# EAGLE design gs (EAGLE 9.6.2)

## Sheet 1 of 2
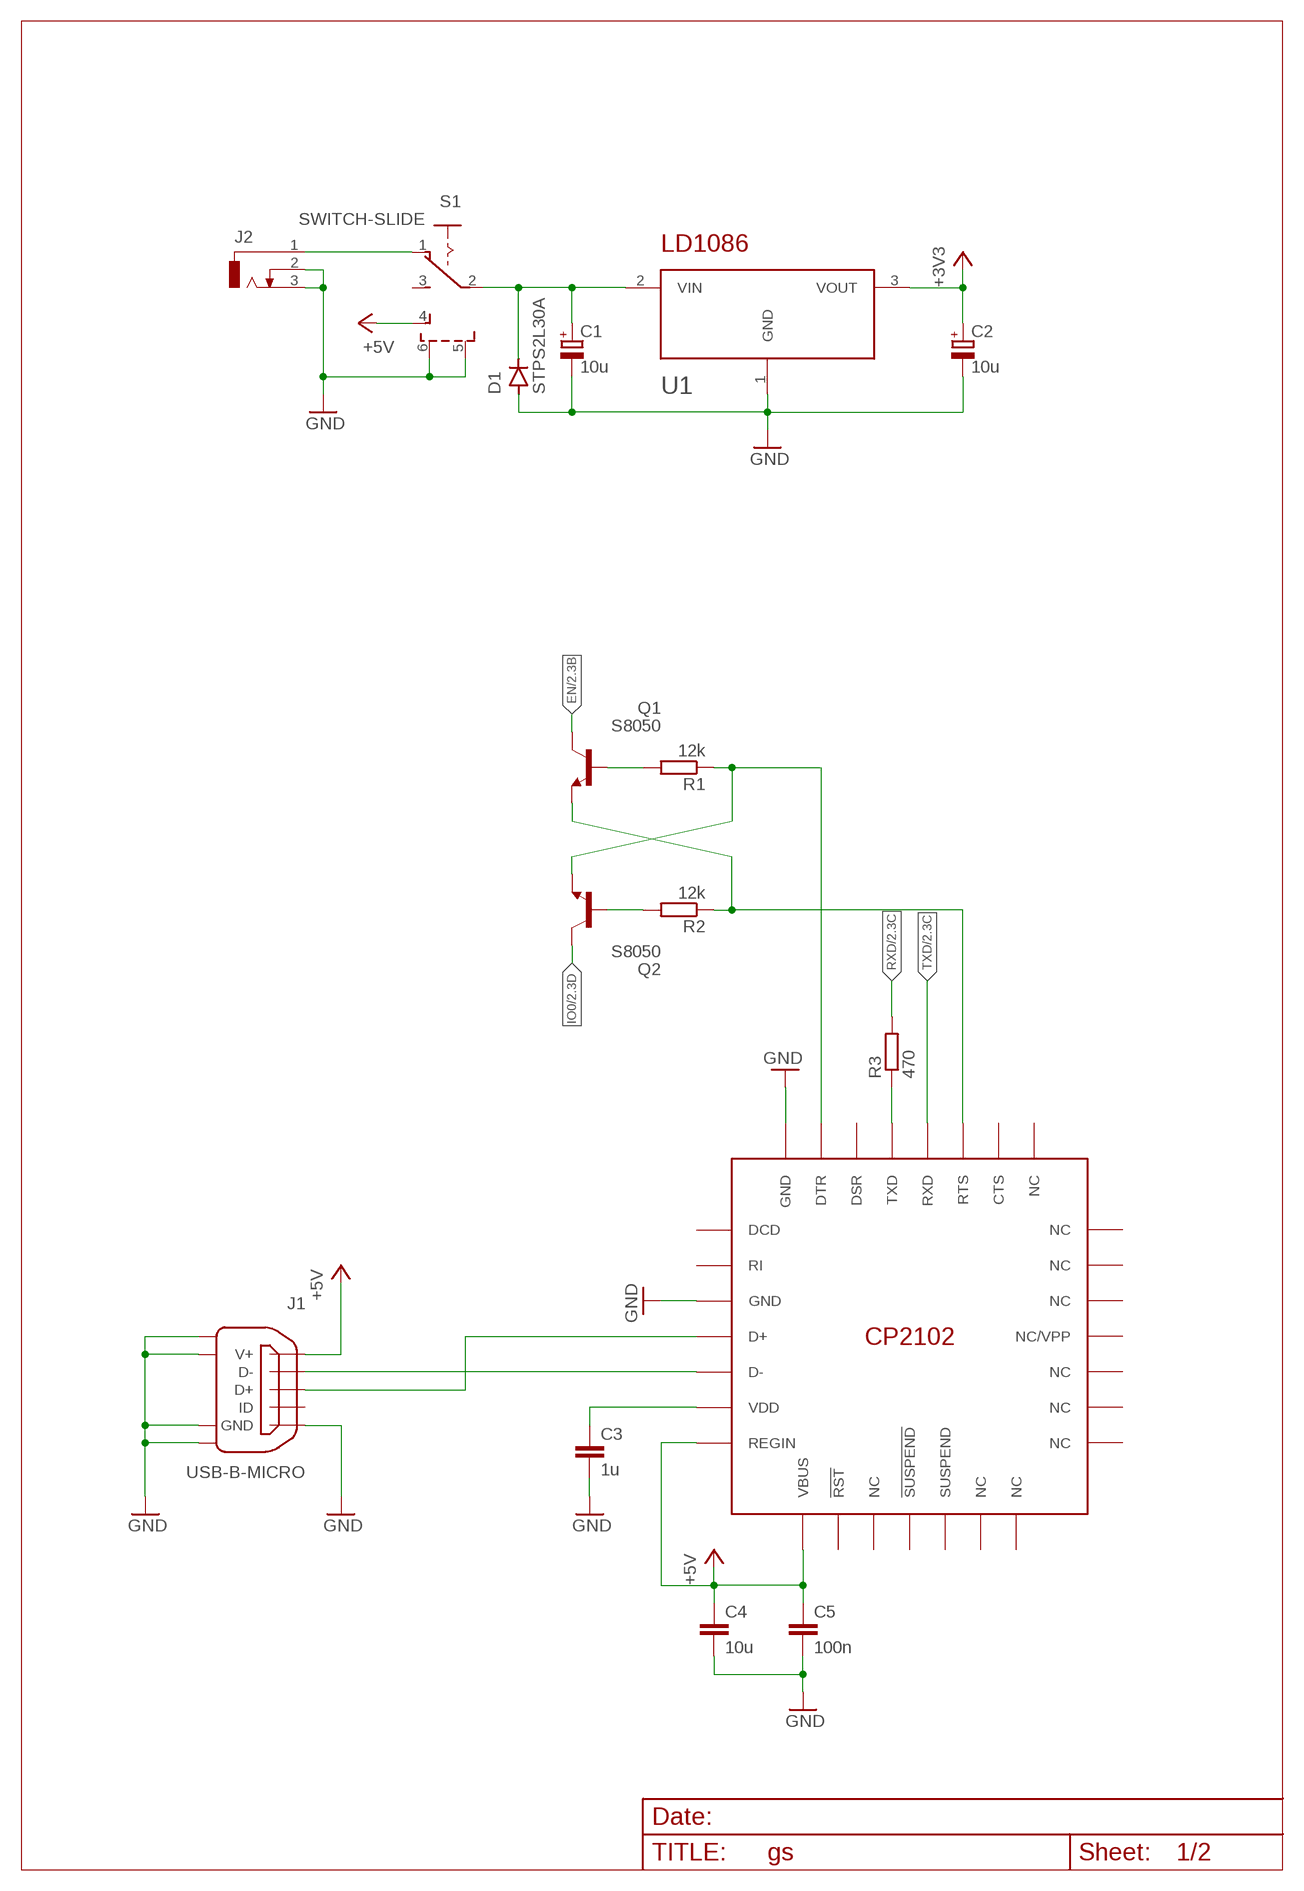
[diagram p0: schematic, sheet 1]

### Parts
C1  10u  CPOL-EUSMCC  [SMC_C]
C2  10u  CPOL-EUSMCC  [SMC_C]
C3  1u  C-EUC0805  [C0805]
C4  10u  C-EUC0805  [C0805]
C5  100n  C-EUC0805  [C0805]
D1  STPS2L30A  [DIOM4225X245N]
J1  USB-B-MICRO  [USB-B-MICRO]
J2  DCJ0303  [DCJ0303]
Q1  S8050  [SOT95P237X110-3N]
Q2  S8050  [SOT95P237X110-3N]
R1  12k  R-EU_R0805  [R0805]
R2  12k  R-EU_R0805  [R0805]
R3  470  R-EU_R0805  [R0805]
S1  SWITCH-SLIDE  [SWITCH-SLIDE]
U1  LD1086DT33TR  [TO228P972X240-3N]
U2  CP2102  [QFN50P500X500X100-29T300N]

### Nets
+3V3: C2.+ U1.3(VOUT) ; also sheet 2
+5V: C4.1 C5.1 J1.1(V+) S1.4 U2.7(REGIN) U2.8(VBUS)
EN: Q1.3(C) ; also sheet 2
GND: C1.- C2.- C3.2 C4.2 C5.2 D1.2(A) J1.5(GND) J1.6 J1.7 J1.8 J1.9 J2.2 J2.3 S1.5(S1) S1.6(S2) U1.1(GND) U2.3(GND) U2.29(GND) ; also sheet 2
IO0: Q2.3(C) ; also sheet 2
N$5: J1.2(D-) U2.5(D-)
N$6: J1.3(D+) U2.4(D+)
N$7: R3.1 U2.26(TXD)
N$8: Q1.1(B) R1.2
N$9: Q2.1(B) R2.2
N$10: Q2.2(E) R1.1 U2.28(DTR)
N$11: Q1.2(E) R2.1 U2.24(RTS)
N$12: C3.1 U2.6(VDD)
N$14: J2.1 S1.1
N$19: C1.+ D1.1(C) S1.2 U1.2(VIN)
RXD: R3.2 ; also sheet 2
TXD: U2.25(RXD) ; also sheet 2
Unconnected: J1.4(ID) S1.3 U2.1(DCD) U2.2(RI) U2.9(!RST) U2.10(NC) U2.11(!SUSPEND) U2.12(SUSPEND) U2.13(NC) U2.14(NC) U2.15(NC) U2.16(NC) U2.17(NC) U2.18(NC/VPP) U2.19(NC) U2.20(NC) U2.21(NC) U2.22(NC) U2.23(CTS) U2.27(DSR)

## Sheet 2 of 2
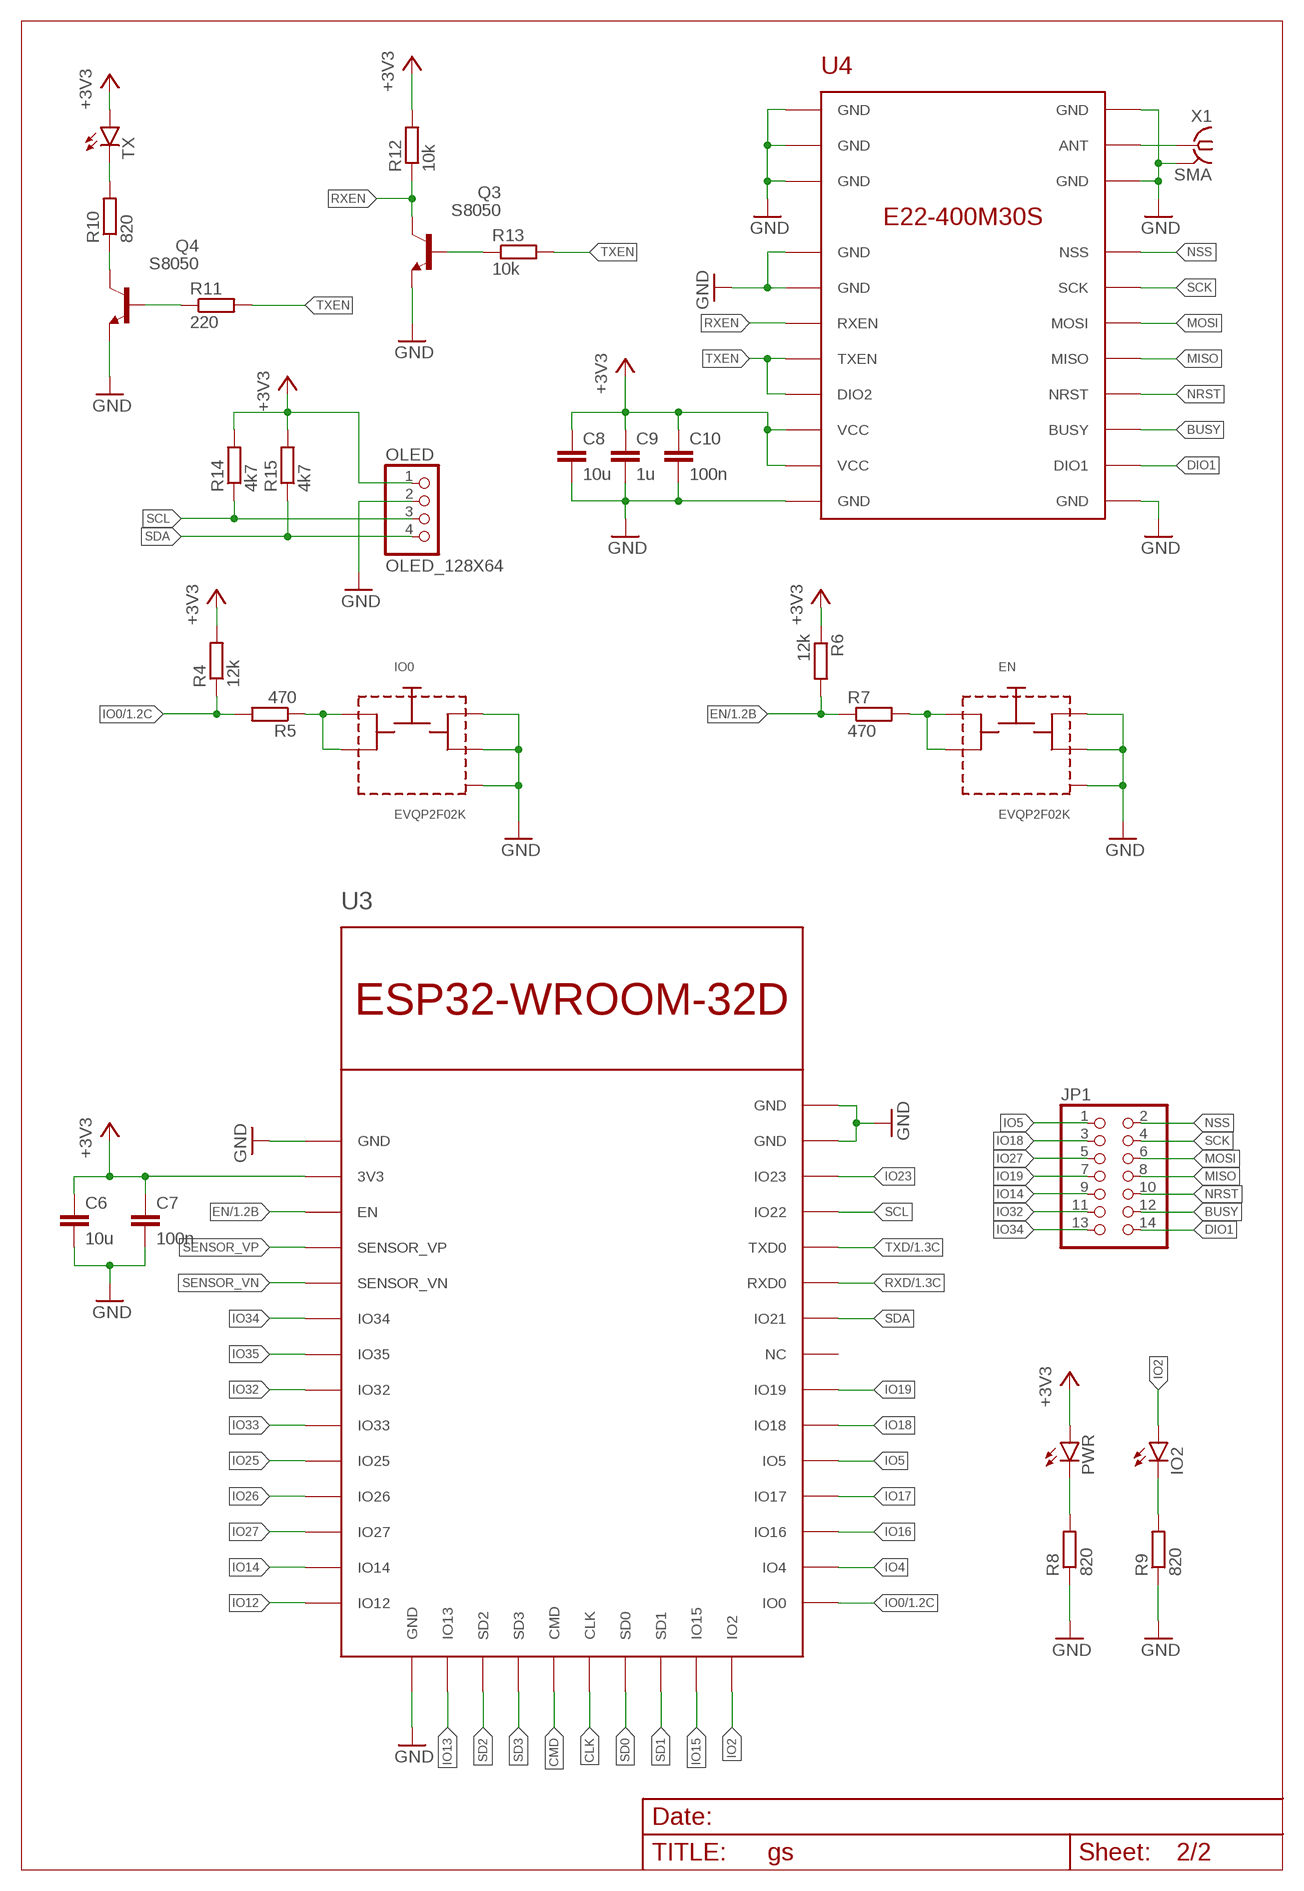
[diagram p1: schematic, sheet 2]

### Parts
C6  10u  C-EUC0805  [C0805]
C7  100n  C-EUC0805  [C0805]
C8  10u  C-EUC0805  [C0805]
C9  1u  C-EUC0805  [C0805]
C10  100n  C-EUC0805  [C0805]
EN  EVQP2F02K  [EVQP2F02K]
IO0  EVQP2F02K  [EVQP2F02K]
IO2  LEDCHIP-LED0805  [CHIP-LED0805]
JP1  PINHD-2X7  [2X07]
OLED  OLED_128X64  [OLED_128X64]
PWR  LEDCHIP-LED0805  [CHIP-LED0805]
Q3  S8050  [SOT95P237X110-3N]
Q4  S8050  [SOT95P237X110-3N]
R4  12k  R-EU_R0805  [R0805]
R5  470  R-EU_R0805  [R0805]
R6  12k  R-EU_R0805  [R0805]
R7  470  R-EU_R0805  [R0805]
R8  820  R-EU_R0805  [R0805]
R9  820  R-EU_R0805  [R0805]
R10  820  R-EU_R0805  [R0805]
R11  220  R-EU_R0805  [R0805]
R12  10k  R-EU_R0805  [R0805]
R13  10k  R-EU_R0805  [R0805]
R14  4k7  R-EU_R0805  [R0805]
R15  4k7  R-EU_R0805  [R0805]
TX  LEDCHIP-LED0805  [CHIP-LED0805]
U3  ESP32-WROOM-32D  [ESP32-SOLO-1]
U4  E22-400M30S  [E22-400M30S]
X1  SMA  [SMA]

### Nets
+3V3: C6.1 C7.1 C8.1 C9.1 C10.1 OLED.1 PWR.A R4.2 R6.1 R12.2 R14.2 R15.2 TX.A U3.2(3V3) U4.9(VCC) U4.10(VCC) ; also sheet 1
BUSY: JP1.12 U4.14(BUSY)
CLK: U3.20(CLK)
CMD: U3.19(CMD)
DIO1: JP1.14 U4.13(DIO1)
EN: R6.2 R7.1 U3.3(EN) ; also sheet 1
GND: C6.2 C7.2 C8.2 C9.2 C10.2 EN.3 EN.4 EN.5 IO0.3 IO0.4 IO0.5 OLED.2 Q3.2(E) Q4.2(E) R8.1 R9.1 U3.1(GND) U3.15(GND) U3.38(GND) U3.39(GND) U4.1(GND) U4.2(GND) U4.3(GND) U4.4(GND) U4.5(GND) U4.11(GND) U4.12(GND) U4.20(GND) U4.22(GND) X1.G@1 X1.G@2 X1.G@3 X1.G@4 ; also sheet 1
IO0: R4.1 R5.2 U3.25(IO0) ; also sheet 1
IO2: IO2.A U3.24(IO2)
IO4: U3.26(IO4)
IO5: JP1.1 U3.29(IO5)
IO12: U3.14(IO12)
IO13: U3.16(IO13)
IO14: JP1.9 U3.13(IO14)
IO15: U3.23(IO15)
IO16: U3.27(IO16)
IO17: U3.28(IO17)
IO18: JP1.3 U3.30(IO18)
IO19: JP1.7 U3.31(IO19)
IO23: U3.37(IO23)
IO25: U3.10(IO25)
IO26: U3.11(IO26)
IO27: JP1.5 U3.12(IO27)
IO32: JP1.11 U3.8(IO32)
IO33: U3.9(IO33)
IO34: JP1.13 U3.6(IO34)
IO35: U3.7(IO35)
MISO: JP1.8 U4.16(MISO)
MOSI: JP1.6 U4.17(MOSI)
N$1: PWR.C R8.2
N$2: IO2.C R9.2
N$3: EN.1 EN.2 R7.2
N$4: IO0.1 IO0.2 R5.1
N$13: U4.21(ANT) X1.1
N$15: Q4.3(C) R10.1
N$16: Q3.1(B) R13.1
N$17: Q4.1(B) R11.1
N$18: R10.2 TX.C
NRST: JP1.10 U4.15(NRST)
NSS: JP1.2 U4.19(NSS)
RXD: U3.34(RXD0) ; also sheet 1
RXEN: Q3.3(C) R12.1 U4.6(RXEN)
SCK: JP1.4 U4.18(SCK)
SCL: OLED.3 R14.1 U3.36(IO22)
SD0: U3.21(SD0)
SD1: U3.22(SD1)
SD2: U3.17(SD2)
SD3: U3.18(SD3)
SDA: OLED.4 R15.1 U3.33(IO21)
SENSOR_VN: U3.5(SENSOR_VN)
SENSOR_VP: U3.4(SENSOR_VP)
TXD: U3.35(TXD0) ; also sheet 1
TXEN: R11.2 R13.2 U4.7(TXEN) U4.8(DIO2)
Unconnected: U3.32(NC)

## Library data of the parts
C1 C2 = rcl:CPOL-EU: POLARIZED CAPACITOR, European symbol; SPICEPREFIX: C; TME: 293D106X9025C2TE3
C3 C9 = rcl:C-EU: CAPACITOR, European symbol; SPICEPREFIX: C; TME: CC0805KKX7R8105
C4 C6 C8 = rcl:C-EU: CAPACITOR, European symbol; SPICEPREFIX: C; TME: CL21A106KAYNNNG
C5 C7 C10 = rcl:C-EU: CAPACITOR, European symbol; SPICEPREFIX: C; TME: CC0805KRX7R8104
D1 = fossa:STPS2L30A; TME: STPS2L30A
EN IO0 = fossa:EVQP2F02K; TME: EVQP2F02K
IO2 PWR TX = led:LED: LED OSRAM: - CHIPLED LG R971, LG N971, LY N971, LG Q971, LY Q971, LO R971, LY R971 LH N974, LH R974 LS Q976, LO Q976, LY Q976 LO Q996 - Hyper CHIPLED LW Q18S LB Q993, LB Q99A, LB R99A - SideLED LS A670, LO A670, LY A670, LG A670, LP A670 LB A673, LV A673, LT A673, LW A673 LH A674 LY A675 LS A676, LA A676, LO A676, LY A676, LW A676 LS A679, LY A679, LG A679 - Hyper Micro SIDELED® LS Y876, LA Y876, LO Y876, LY Y876 LT Y87S - SmartLED LW L88C, LW L88S LB L89C, LB L89S, LG L890 LS L89K, LO L89K, LY L89K LS L896, LA L896, LO L896, LY L896 - TOPLED LS T670, LO T670, LY T670, LG T670, LP T670 LSG T670, LSP T670, LSY T670, LOP T670, LYG T670 LG T671, LOG T671, LSG T671 LB T673, LV T673, LT T673, LW T673 LH T674 LS T676, LA T676, LO T676, LY T676, LB T676, LH T676, LSB T676, LW T676 LB T67C, LV T67C, LT T67C, LS T67K, LO T67K, LY T67K, LW E67C LS E67B, LA E67B, LO E67B, LY E67B, LB E67C, LV E67C, LT E67C LW T67C LS T679, LY T679, LG T679 LS T770, LO T770, LY T770, LG T770, LP T770 LB T773, LV T773, LT T773, LW T773 LH T774 LS E675, LA E675, LY E675, LS T675 LS T776, LA T776, LO T776, LY T776, LB T776 LHGB T686 LT T68C, LB T68C - Hyper Mini TOPLED® LB M676 - Mini TOPLED Santana® LG M470 LS M47K, LO M47K, LY M47K Source: http://www.osram.convergy.de LUXEON: - LUMILED® LXK2-PW12-R00, LXK2-PW12-S00, LXK2-PW14-U00, LXK2-PW14-V00 LXK2-PM12-R00, LXK2-PM12-S00, LXK2-PM14-U00 LXK2-PE12-Q00, LXK2-PE12-R00, LXK2-PE12-S00, LXK2-PE14-T00, LXK2-PE14-U00 LXK2-PB12-K00, LXK2-PB12-L00, LXK2-PB12-M00, LXK2-PB14-N00, LXK2-PB14-P00, LXK2-PB14-Q00 LXK2-PR12-L00, LXK2-PR12-M00, LXK2-PR14-Q00, LXK2-PR14-R00 LXK2-PD12-Q00, LXK2-PD12-R00, LXK2-PD12-S00 LXK2-PH12-R00, LXK2-PH12-S00 LXK2-PL12-P00, LXK2-PL12-Q00, LXK2-PL12-R00 Source: www.luxeon.com KINGBRIGHT: KA-3528ASYC Source: www.kingbright.com; TME: KP-2012LSURCK
J1 = fossa:USB-B-MICRO; TME: 10118193-0001LF/C
J2 = fossa:DCJ0303: DC POWER JACK Source: DCJ0303.pdf; TME: 1613-21
JP1 = pinhead:PINHD-2X7: PIN HEADER
OLED = fossa:OLED_128X64
Q1-Q4 = fossa:S8050; TME: MMSS8050-H-TP
R1 R2 R4 R6 = rcl:R-EU_: RESISTOR, European symbol; SPICEPREFIX: R; TME: SMD0805-12K
R3 R5 R7 = rcl:R-EU_: RESISTOR, European symbol; SPICEPREFIX: R; TME: SMD0805-470R
R8-R10 = rcl:R-EU_: RESISTOR, European symbol; SPICEPREFIX: R; TME: SMD0805-820R
R11 = rcl:R-EU_: RESISTOR, European symbol; SPICEPREFIX: R; TME: SMD0805-220R
R12 R13 = rcl:R-EU_: RESISTOR, European symbol; SPICEPREFIX: R; TME: SMD0805-10K
R14 R15 = rcl:R-EU_: RESISTOR, European symbol; SPICEPREFIX: R; TME: SMD0805-4K7
S1 = fossa:SWITCH-SLIDE; TME: OS103011MA7QP1
U1 = fossa:LD1086DT33TR; TME: LD1086DT33TR
U2 = fossa:CP2102; TME: CP2102-GM
U3 = fossa:ESP32-WROOM-32D; TME: ESP32-WROOM-32D
U4 = fossa:E22-400M30S
X1 = fossa:SMA: SMA 50 Ohm End Launch Jack Receptacle - Round Contact Johnson Components Source: www.johnsoncomponents.com .. J502-ND.pdf; TME: RF2145AT1750GHDW

## Board
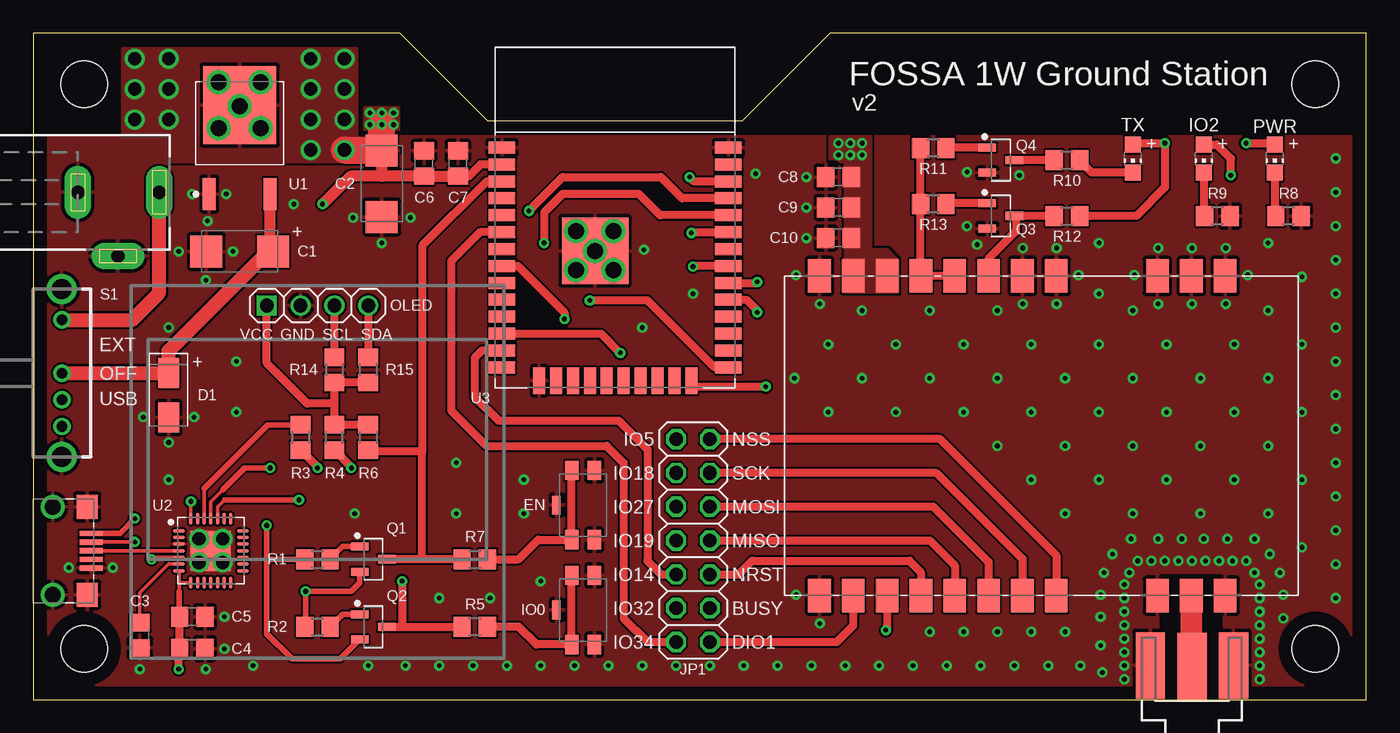
[diagram p2: board, top side]
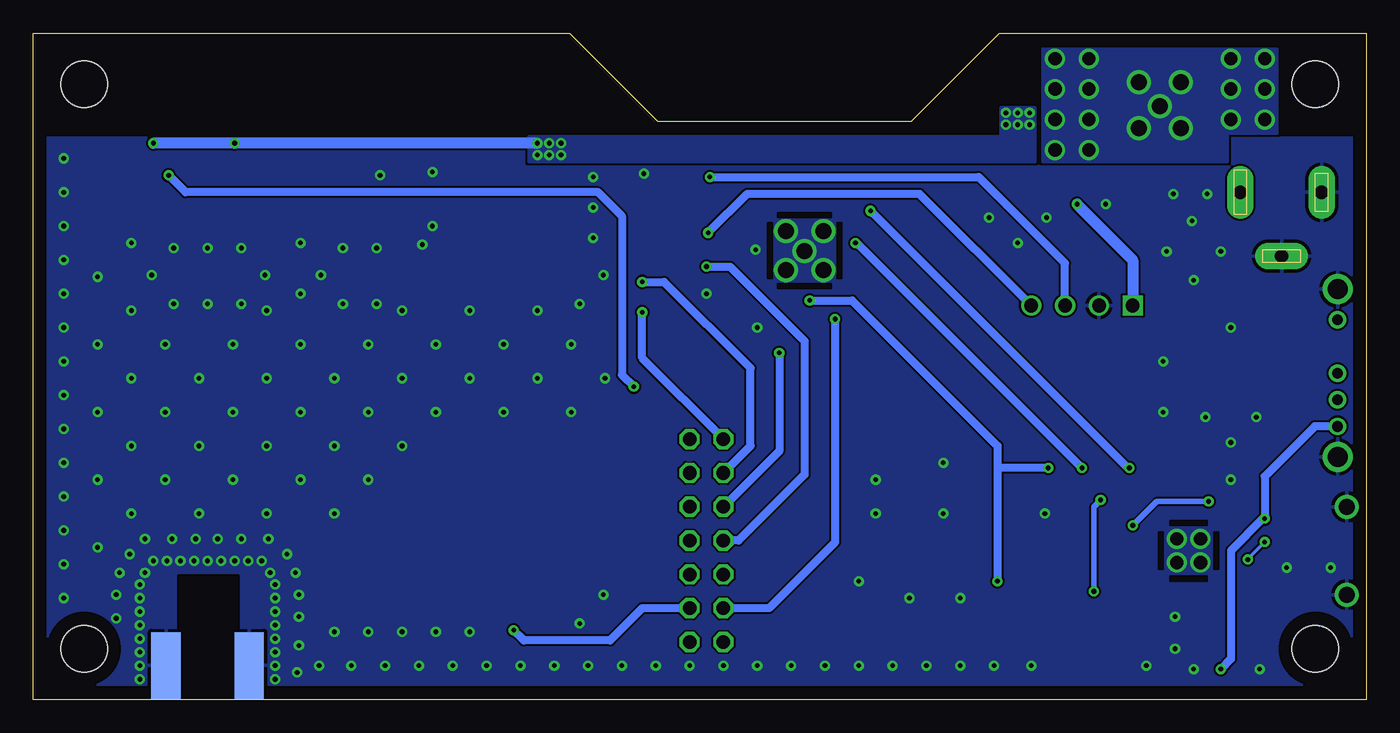
[diagram p3: board, bottom side, seen from below]

Size 100.08 x 50.04 mm. Coordinates in mm from the lower left corner, seen from the top.
Outline: 0,0 100.08,0 100.08,50.04 59.82,50.04 53.21,43.43 34.16,43.43 27.56,50.04 0,50.04 0,0
Copper layers (1*16): Top 0.035mm / dielectric 1.5mm / Bottom 0.035mm
Design rules "default": minimum track width 6mil, minimum drill 0.35mm, track to track 6mil, track to pad 6mil, pad to pad 6mil, via to via 6mil, smd to smd 6mil, copper to edge 40mil, drill to drill 6mil, minimum pad ring 10mil, minimum via ring 8mil, stop-mask expansion 4mil, vias tented up to drill 0mil, thermal gap 10mil
Holes 3.5 mm at 3.81,3.81 3.81,46.23 96.27,46.23 96.27,3.81

### Footprints (pad centres in the part's own frame; a part is rotated, then mirrored left to right if it is on the bottom)
SMC_C = smd 2.4 x 2.4: + -2.5,0; - 2.5,0
C0805 = smd 1.3 x 1.5: 1 -0.95,0; 2 0.95,0
DIOM4225X245N = smd 2.256 x 1.565: 1 -1.677,0; 2 1.677,0
EVQP2F02K = smd 1 x 1.45: 1 -0.85,2.6; 2 -0.85,-2.6; 3 0.85,2.6; 4 0.85,-2.6 | smd 0.65 x 1.4: 5 -2,0
CHIP-LED0805 = smd 1.2 x 1.2: A 0,-1.05; C 0,1.05
USB-B-MICRO = smd 0.4 x 1.75: 1 -1.3,4.35; 2 -0.65,4.35; 3 0,4.35; 4 0.65,4.35; 5 1.3,4.35 | smd 1.8 x 1.6: 6 -3.3,4.05; 8 3.3,4.05 | drill 1.2: 7 -3.3,1.45; 9 3.3,1.45
DCJ0303 = drill 1 pad 2 long: 1 0,3.1; 2 4.8,0; 3 0,-3
2X07 = drill 1.016 octagon: 1 -7.62,-1.27; 2 -7.62,1.27; 3 -5.08,-1.27; 4 -5.08,1.27; 5 -2.54,-1.27; 6 -2.54,1.27; 7 0,-1.27; 8 0,1.27; 9 2.54,-1.27; 10 2.54,1.27; 11 5.08,-1.27; 12 5.08,1.27; 13 7.62,-1.27; 14 7.62,1.27
OLED_128X64 = drill 1.016 square: 1 -3.81,0 | drill 1.016: 2 -1.27,0; 3 1.27,0; 4 3.81,0
SOT95P237X110-3N = smd 1.322 x 0.609: 1 -1.014,0.95; 2 -1.014,-0.95; 3 1.014,0
R0805 = smd 1.3 x 1.5: 1 -0.95,0; 2 0.95,0
SWITCH-SLIDE = drill 0.8: 1 -4,2.15; 2 0,2.15; 3 2,2.15; 4 4,2.15 | drill 1.5: 5 -6.3,2.15; 6 6.3,2.15
TO228P972X240-3N = smd 2.402 x 0.983: 1 -4.203,2.28; 2 -4.203,-2.28 | smd 5.863 x 5.489: 3 2.473,0
QFN50P500X500X100-29T300N = smd 0.919 x 0.27: 1 -2.396,1.5; 2 -2.396,1; 3 -2.396,0.5; 4 -2.396,0; 5 -2.396,-0.5; 6 -2.396,-1; 7 -2.396,-1.5; 15 2.396,-1.5; 16 2.396,-1; 17 2.396,-0.5; 18 2.396,0; 19 2.396,0.5; 20 2.396,1; 21 2.396,1.5 | smd 0.27 x 0.919: 8 -1.5,-2.396; 9 -1,-2.396; 10 -0.5,-2.396; 11 0,-2.396; 12 0.5,-2.396; 13 1,-2.396; 14 1.5,-2.396; 22 1.5,2.396; 23 1,2.396; 24 0.5,2.396; 25 0,2.396; 26 -0.5,2.396; 27 -1,2.396; 28 -1.5,2.396 | smd 3 x 3: 29 0,0
ESP32-SOLO-1 = smd 2 x 0.9: 1 -8.5,5.26; 2 -8.5,3.99; 3 -8.5,2.72; 4 -8.5,1.45; 5 -8.5,0.18; 6 -8.5,-1.09; 7 -8.5,-2.36; 8 -8.5,-3.63; 9 -8.5,-4.9; 10 -8.5,-6.17; 11 -8.5,-7.44; 12 -8.5,-8.71; 13 -8.5,-9.98; 14 -8.5,-11.25; 25 8.5,-11.25; 26 8.5,-9.98; 27 8.5,-8.71; 28 8.5,-7.44; 29 8.5,-6.17; 30 8.5,-4.9; 31 8.5,-3.63; 32 8.5,-2.36; 33 8.5,-1.09; 34 8.5,0.18; 35 8.5,1.45; 36 8.5,2.72; 37 8.5,3.99; 38 8.5,5.26 | smd 0.9 x 2: 15 -5.715,-12.25; 16 -4.445,-12.25; 17 -3.175,-12.25; 18 -1.905,-12.25; 19 -0.635,-12.25; 20 0.635,-12.25; 21 1.905,-12.25; 22 3.175,-12.25; 23 4.445,-12.25; 24 5.715,-12.25 | smd 5 x 5: 39 -1.5,-2.5
E22-400M30S = smd 2.5 x 1.7: 1 -12,13.79; 2 -12,11.25; 3 -12,8.71; 4 -12,1.11; 5 -12,-1.43; 6 -12,-3.97; 7 -12,-6.51; 8 -12,-9.05; 9 -12,-11.59; 10 -12,-14.13; 11 -12,-16.67; 12 12,-16.67; 13 12,-14.13; 14 12,-11.59; 15 12,-9.05; 16 12,-6.51; 17 12,-3.97; 18 12,-1.43; 19 12,1.11; 20 12,8.71; 21 12,11.25; 22 12,13.79
SMA = smd 5 x 2.2: 1 2.5,0; G@1 2.565,3.12; G@2 2.565,-3.12 | smd 5 x 2.2 bottom: G@3 2.565,3.12; G@4 2.565,-3.12

### Placement (x,y rotation side)
C1  15.49,33.66 180 top
C2  26.16,38.73 270 top
C3  8,4.83 270 top
C4  11.94,3.81 0 top
C5  11.94,6.22 0 top
C6  29.34,40.26 90 top
C7  31.88,40.26 90 top
C8  60.45,39.24 180 top
C9  60.45,36.96 180 top
C10  60.45,34.67 180 top
D1  10.16,22.86 270 top
EN  41.27,14.61 0 top
IO0  41.27,6.73 0 top
IO2  87.88,40.64 180 top
J1  0,11.18 270 top
J2  6.35,38.1 270 top
JP1  49.53,11.94 270 top
OLED  21.34,29.59 0 top
PWR  93.22,40.64 180 top
Q1  25.53,10.54 0 top
Q2  25.53,5.46 0 top
Q3  72.64,36.32 0 top
Q4  72.64,40.51 0 top
R1  21.34,10.54 0 top
R2  21.34,5.46 0 top
R3  20.07,19.68 270 top
R4  22.61,19.68 90 top
R5  33.15,5.46 180 top
R6  25.15,19.68 270 top
R7  33.15,10.54 0 top
R8  94.23,36.32 180 top
R9  88.9,36.32 180 top
R10  77.6,40.51 0 top
R11  67.56,41.4 180 top
R12  77.6,36.32 0 top
R13  67.56,37.21 180 top
R14  22.61,24.77 270 top
R15  25.15,24.77 270 top
S1  0,24.51 270 top
TX  82.55,40.64 180 top
U1  15.49,42.16 90 top
U2  13.34,11.18 0 top
U3  43.69,36.2 0 top
U4  75.69,19.81 270 top
X1  87,0 90 top

### Tracks (layer width: path | path; a pad name or v marks a point on that pad's centre or on a via)
+3V3  (via drill 0.35, 1, 1.2)
  Top 0.61: R12.2 82.8,36.32 84.96,38.48 v84.96,41.78 82.64,41.78 TX.A | R6.1 R4.2 22.61,22.23 | R15.2 R14.2 22.61,22.23 | 22.61,22.23 20.57,22.23 17.53,25.27 OLED.1 | C7.1 32.7,39.31 33.58,40.19 U3.2 | v91.06,41.78 93.12,41.78 PWR.A
  Top 0.813: C7.1 C6.1 26.16,39.31 | C2.+ 26.16,39.31 | 26.16,39.31 23.82,39.31 v21.72,37.21
  Top 2.032: v23.37,41.27 26.16,41.27 | C2.+ 26.16,41.27 | 26.16,41.27 v26.16,43.18
  Bottom 0.61: v62.23,41.78 62.36,41.66
  Bottom 0.813: v21.72,37.21 17.53,33.02 OLED.1 | v62.23,41.78 v84.96,41.78 v91.06,41.78
  other vias: 13.92,42.9 17.07,42.9 13.92,46.35 17.07,46.35 61.34,41.78 61.34,40.89 60.45,41.78 60.45,40.89 15.49,44.58 7.62,48.13 7.62,45.85 7.62,43.56 23.37,48.13 23.37,45.85 23.37,43.56 10.16,48.13 20.83,48.13 20.83,41.27 10.16,45.85 10.16,43.56 20.83,43.56 20.83,45.85 62.23,40.89 25.27,44.07 26.16,44.07 25.27,43.18 27.05,43.18 27.05,44.07
  pour Top (isolate 0.508): 24.26,48.9 6.73,48.9 6.73,42.55 10.41,42.55 10.41,40.39 27.43,40.39 27.43,44.45 24.89,44.45 24.89,42.16 24.26,42.16
  pour Bottom (isolate 0.508): 24.26,48.9 6.73,48.9 6.73,42.55 10.41,42.55 10.41,40.39 24.26,40.39
  pour Top (isolate 0.508, no thermals): 60.96,30.61 64.9,30.61 64.9,33.02 64.14,33.78 62.87,33.78 62.87,42.29 59.82,42.29 59.82,40.39 60.96,40.39
  pour Bottom: 24.89,44.45 24.89,40.39 62.87,40.39 62.87,42.29 27.43,42.29 27.43,44.45
+5V  (via drill 0.35)
  Top 0.254: U2.7 10.94,8.76 | 10.94,8.76 11.82,8.76 U2.8 | 10.94,8.76 10.94,8.11
  Top 0.406: J1.1 6.51,12.48 v7.62,13.59 | 10.94,8.11 10.94,6.27 C5.1
  Top 0.61: v10.92,2.29 10.92,3.74 C4.1 C5.1
  Bottom 0.61: v10.92,2.29 10.16,3.05 10.16,11.18 7.75,13.59 v7.62,13.59 7.62,16.76 3.87,20.51 S1.4
BUSY  (via drill 0.35)
  Top 0.61: U4.14 64.1,5.3 v64.01,5.21
  Bottom 0.61: JP1.12 54.36,6.86 56.77,4.45 63.25,4.45 v64.01,5.21
DIO1
  Top 0.61: JP1.14 60.33,4.32 61.56,5.55 U4.13
EN
  Top 0.61: R7.1 29.21,10.54 | 29.21,10.54 Q1.3 | 29.21,10.54 29.21,18.67 | 29.21,18.67 29.21,34.08 34.05,38.91 U3.3 | R6.2 25.21,18.67 29.21,18.67
GND  (via drill 0.35, 1, 1.2)
  other vias: 40.77,35.18 43.56,35.18 42.16,33.68 40.77,32.26 43.56,32.26 12.45,12.06 14.22,12.06 14.22,10.29 12.45,10.29 76.83,33.91 74.3,33.91 78.49,31.88 76.83,29.72 74.3,29.72 84.45,33.91 87,33.91 89.53,33.91 82.68,31.88 91.19,31.88 89.53,29.72 87,29.72 84.45,29.72 58.04,39.24 58.04,36.96 58.04,34.67 57.28,31.88 59.05,29.72 57.28,7.87 59.05,5.71 14.48,37.97 13.08,35.94 11.94,37.97 14.99,33.66 19.56,37.21 26.16,34.29 8,2.29 14.35,3.81 14.35,6.22 12.95,2.29 2.67,9.91 5.97,9.91 10.16,19.3 81.92,1.52 81.92,2.54 81.92,3.56 81.92,4.57 81.92,5.59 81.92,6.6 81.92,7.62 81.92,8.64 82.3,9.53 82.93,10.41 83.95,10.41 84.96,10.41 85.98,10.41 87,10.41 88.01,10.41 89.03,10.41 90.04,10.41 91.06,10.41 91.69,9.53 92.08,8.64 92.08,7.62 92.08,6.6 92.08,5.59 92.08,4.57 92.08,3.56 92.08,2.54 92.08,1.52 80.26,2.03 80.14,4.06 80.14,6.22 80.14,7.87 80.39,9.53 93.85,6.1 81.03,10.92 82.42,12.06 84.45,12.06 86.23,12.06 91.69,12.06 89.66,12.06 87.88,12.06 93.85,7.87 93.6,9.53 92.84,10.92 12.06,21.21 8.26,21.21 24,36.2 82.55,19.05 87.63,19.05 82.55,13.97 87.63,13.97 92.71,13.97 92.71,19.05 97.79,22.86 97.79,17.78 97.79,12.7 97.79,7.62 97.79,25.4 97.79,27.94 97.79,30.48 92.71,24.13 87.63,24.13 82.55,24.13 77.47,24.13 72.39,24.13 67.31,24.13 62.23,24.13 57.15,24.13 92.71,29.21 77.47,19.05 72.39,19.05 77.47,13.97 80.01,21.59 74.93,21.59 85.09,21.59 90.17,21.59 90.17,26.67 85.09,26.67 95.25,26.67 95.25,21.59 95.25,16.51 90.17,16.51 85.09,16.51 80.01,16.51 74.93,16.51 69.85,21.59 64.77,21.59 59.69,21.59 72.39,29.21 67.31,29.21 62.23,29.21 80.01,26.67 95.25,31.75 95.25,11.43 76.2,2.54 71.12,2.54 66.04,2.54 68.58,2.54 73.66,2.54 97.79,10.16 97.79,15.24 97.79,20.32 97.79,33.02 97.79,35.56 97.79,38.1 97.79,40.64 63.5,2.54 60.96,2.54 58.42,2.54 55.88,2.54 53.34,2.54 50.8,2.54 48.26,2.54 45.72,2.54 43.18,2.54 25.15,2.54 16.51,2.54 10.16,16.51 10.16,27.94 10.92,33.66 70.1,35.56 70.87,34.16 70.1,39.62 74.04,39.37 78.61,2.54 12.95,31.5 54.23,39.5 45.85,33.78 28.32,36.2 74.93,26.67 69.85,26.67 64.77,26.67 59.69,26.67 80.01,30.48 82.55,29.21 40.64,2.54 38.1,2.54 35.56,2.54 33.02,2.54 30.48,2.54 27.94,2.54 80.01,34.29 92.71,34.29 31.75,13.97 31.75,17.78 36.83,13.97 36.83,16.51 30.48,7.62 34.29,7.62 38.1,8.89 24.13,13.97 15.24,25.4 15.24,21.59 49.53,30.48 45.72,27.94 77.47,5.08 74.93,5.08 72.39,5.08 69.85,5.08 67.31,5.08
  pour Top (rank 6): -1.27,42.29 101.35,42.29 101.35,-1.27 -1.27,-1.27
  pour Bottom (rank 6): -2.54,42.16 101.85,42.16 101.85,-2.54 -2.54,-2.54
  cutout Bottom: 39.75,35.81 39.75,31.62 39.37,31.62 39.37,35.81
  cutout Bottom: 40.13,36.2 40.13,36.58 44.2,36.58 44.2,36.2
  cutout Bottom: 44.96,35.81 44.96,31.62 44.58,31.62 44.58,35.81
  cutout Bottom: 40.13,30.86 40.13,31.24 44.2,31.24 44.2,30.86
  cutout Bottom: 15.62,12.57 15.62,9.78 15.24,9.78 15.24,12.57
  cutout Bottom: 11.43,12.57 11.43,9.78 11.05,9.78 11.05,12.57
  cutout Bottom: 11.94,13.46 14.73,13.46 14.73,13.08 11.94,13.08
  cutout Bottom: 11.94,9.27 14.73,9.27 14.73,8.89 11.94,8.89
  cutout Bottom: 84.71,9.27 89.15,9.27 89.15,-0.13 84.71,-0.13
  cutout Top: 84.71,9.27 89.15,9.27 89.15,-0.13 84.71,-0.13
IO0  (via drill 0.35)
  Top 0.61: U3.25 51.13,24.95 46.1,29.97 v41.78,29.97 | Q2.3 27.69,5.46 | 27.69,5.46 R5.2 | v27.69,8.89 27.69,5.46 | R4.1 23.88,17.46 v23.88,17.4
  Bottom 0.61: v41.78,29.97 38.61,29.97 27.69,19.05 27.69,17.4 | 27.69,17.4 v27.69,8.89 | v23.88,17.4 27.69,17.4
IO2  (via drill 0.35)
  Top 0.61: U3.24 49.4,23.5 v54.99,23.5 | v89.92,39.37 89.92,40.64 88.87,41.69 IO2.A
  Bottom 0.61: v54.99,23.5 55.88,24.38 55.88,36.32 57.66,38.1 88.65,38.1 v89.92,39.37
IO5  (via drill 0.35)
  Top 0.61: U3.29 53.54,30.02 54.36,29.21 v54.36,29.08
  Bottom 0.61: v54.36,29.08 54.36,25.65 JP1.1
IO14
  Top 0.61: U3.13 33.71,26.21 33.15,25.65 33.15,22.73 34.92,20.95 43.94,20.95 46.1,18.8 46.1,10.41 47.12,9.4 JP1.9
IO18  (via drill 0.35)
  Top 0.61: v54.36,31.37 54.28,31.3 U3.30
  Bottom 0.61: JP1.3 46.23,19.05 46.23,24.89 52.7,31.37 v54.36,31.37
IO19  (via drill 0.35)
  Top 0.61: U3.31 49.58,32.56 v49.53,32.51
  Bottom 0.61: v49.53,32.51 47.75,32.51 42.16,26.92 42.16,16.89 47.12,11.94 JP1.7
IO27  (via drill 0.35)
  Top 0.61: v44.07,26.04 42.62,27.48 U3.12
  Bottom 0.61: v44.07,26.04 44.07,18.67 JP1.5
IO32  (via drill 0.35)
  Top 0.61: v39.88,28.57 39.88,29.08 36.4,32.56 U3.8
  Bottom 0.61: v39.88,28.57 39.88,11.81 44.83,6.86 JP1.11
IO34
  Top 0.61: U3.6 33.54,35.1 31.38,32.95 31.38,21.71 34.04,19.05 43.05,19.05 44.32,17.78 44.32,6.1 46.1,4.32 JP1.13
MISO
  Top 0.61: U4.16 69.18,10.07 67.31,11.94 JP1.8
MOSI
  Top 0.61: U4.17 71.72,10.32 67.56,14.48 JP1.6
N$1
  Top 0.61: PWR.C 93.22,36.39 R8.2
N$2
  Top 0.61: IO2.C 87.88,36.39 R9.2
N$3
  Top 0.61: R7.2 36.45,10.54 37.91,12.01 EN.2 EN.1
N$4
  Top 0.61: R5.1 36.45,5.46 37.78,4.13 IO0.2 IO0.1
N$5  (via drill 0.35)
  Top 0.254: J1.2 v7.61,11.83 v7.62,11.83 | v8.89,10.52 9.05,10.68 U2.5
  Bottom 0.254: v8.89,10.52 8.89,10.56 v7.62,11.83
N$6
  Top 0.254: J1.3 U2.4
N$7
  Top 0.254: U2.26 12.84,15.87
  Top 0.406: R3.1 17.6,20.64 12.84,15.87
N$8
  Top 0.406: Q1.1 23.24,11.49 R1.2
N$9
  Top 0.406: Q2.1 23.24,6.41 R2.2
N$10  (via drill 0.35)
  Top 0.254: U2.28 v11.84,14.88
  Top 0.406: Q2.2 23.05,3.05 19.43,3.05 17.53,4.95 17.53,10.54 | 17.53,10.54 v17.53,13.08 | R1.1 17.53,10.54
  Bottom 0.406: v11.84,14.88 15.72,14.88 v17.53,13.08
N$11  (via drill 0.35)
  Top 0.254: U2.24 13.84,14.47 14.35,14.99
  Top 0.406: R2.1 20.45,5.52 v20.45,8.13 23.88,8.13 24.51,8.76 Q1.2 | 14.35,14.99 v19.94,14.99
  Bottom 0.406: v19.94,14.99 20.45,14.48 v20.45,8.13
N$12
  Top 0.254: U2.6 10.18,10.18 8,8 C3.1
N$13
  Top 1.626: U4.21 86.94,2.62 X1.1
N$14
  Top 1.067: S1.1 7.43,28.51 9.45,30.53 J2.1
N$15
  Top 0.61: R10.1 Q4.3
N$16
  Top 0.61: Q3.1 68.58,37.27 R13.1
N$17
  Top 0.61: Q4.1 68.58,41.46 R11.1
N$18
  Top 0.61: TX.C 79.47,39.59 R10.2
N$19
  Top 0.813: C1.+ 17.77,33.88 U1.2
  Top 1.067: S1.2 10.13,24.51 D1.1 10.16,26.19 17.63,33.66 C1.+
NRST
  Top 0.61: JP1.10 52.96,9.4 53.98,10.41 65.79,10.41 66.64,9.56 U4.15
NSS
  Top 0.61: U4.19 76.8,10.83 68.07,19.56 JP1.2
RXD  (via drill 0.35)
  Top 0.61: U3.34 47.06,36.38 45.47,37.97 39.75,37.97 38.35,36.58 v38.35,34.29 | v21.34,17.4 21.34,17.46 R3.2
  Bottom 0.61: v38.35,34.29 38.23,34.29 v21.34,17.4
RXEN
  Top 0.61: U4.6 71.72,33.11 73.79,35.18 73.79,36.19 Q3.3 R12.1
SCK
  Top 0.61: U4.18 74.26,10.57 67.82,17.02 JP1.4
SCL  (via drill 0.35)
  Top 0.61: R14.1 OLED.3 | U3.36 49.6,38.91 v49.28,39.24
  Bottom 0.61: OLED.3 22.61,32.77 29.08,39.24 v49.28,39.24
SDA  (via drill 0.35)
  Top 0.61: OLED.4 R15.1 | v49.4,35.05 49.46,35.1 U3.33
  Bottom 0.61: OLED.4 33.53,37.97 46.48,37.97 v49.4,35.05
TXD  (via drill 0.35)
  Top 0.254: U2.25 13.34,14.86 14.22,15.75
  Top 0.406: 14.22,15.75 15.88,17.4 v17.78,17.4
  Top 0.61: U3.35 48.72,37.65 47.12,39.24 39.75,39.24 v37.21,36.7
  Bottom 0.61: v37.21,36.7 17.91,17.4 v17.78,17.4
TXEN
  Top 0.61: R11.2 R13.2 66.61,31.84 U4.8 U4.7

### Text on the board
tNames: FOSSA 1W Ground Station | v2 | + | + | + | + | VCC | GND | SCL | SDA | EXT | OFF | + | USB | IO5 | NSS | IO18 | SCK | IO27 | MOSI | IO19 | MISO | IO14 | NRST | IO32 | BUSY | IO34 | DIO1